# Altium schematic sheet sem8700.SchDoc
size A3
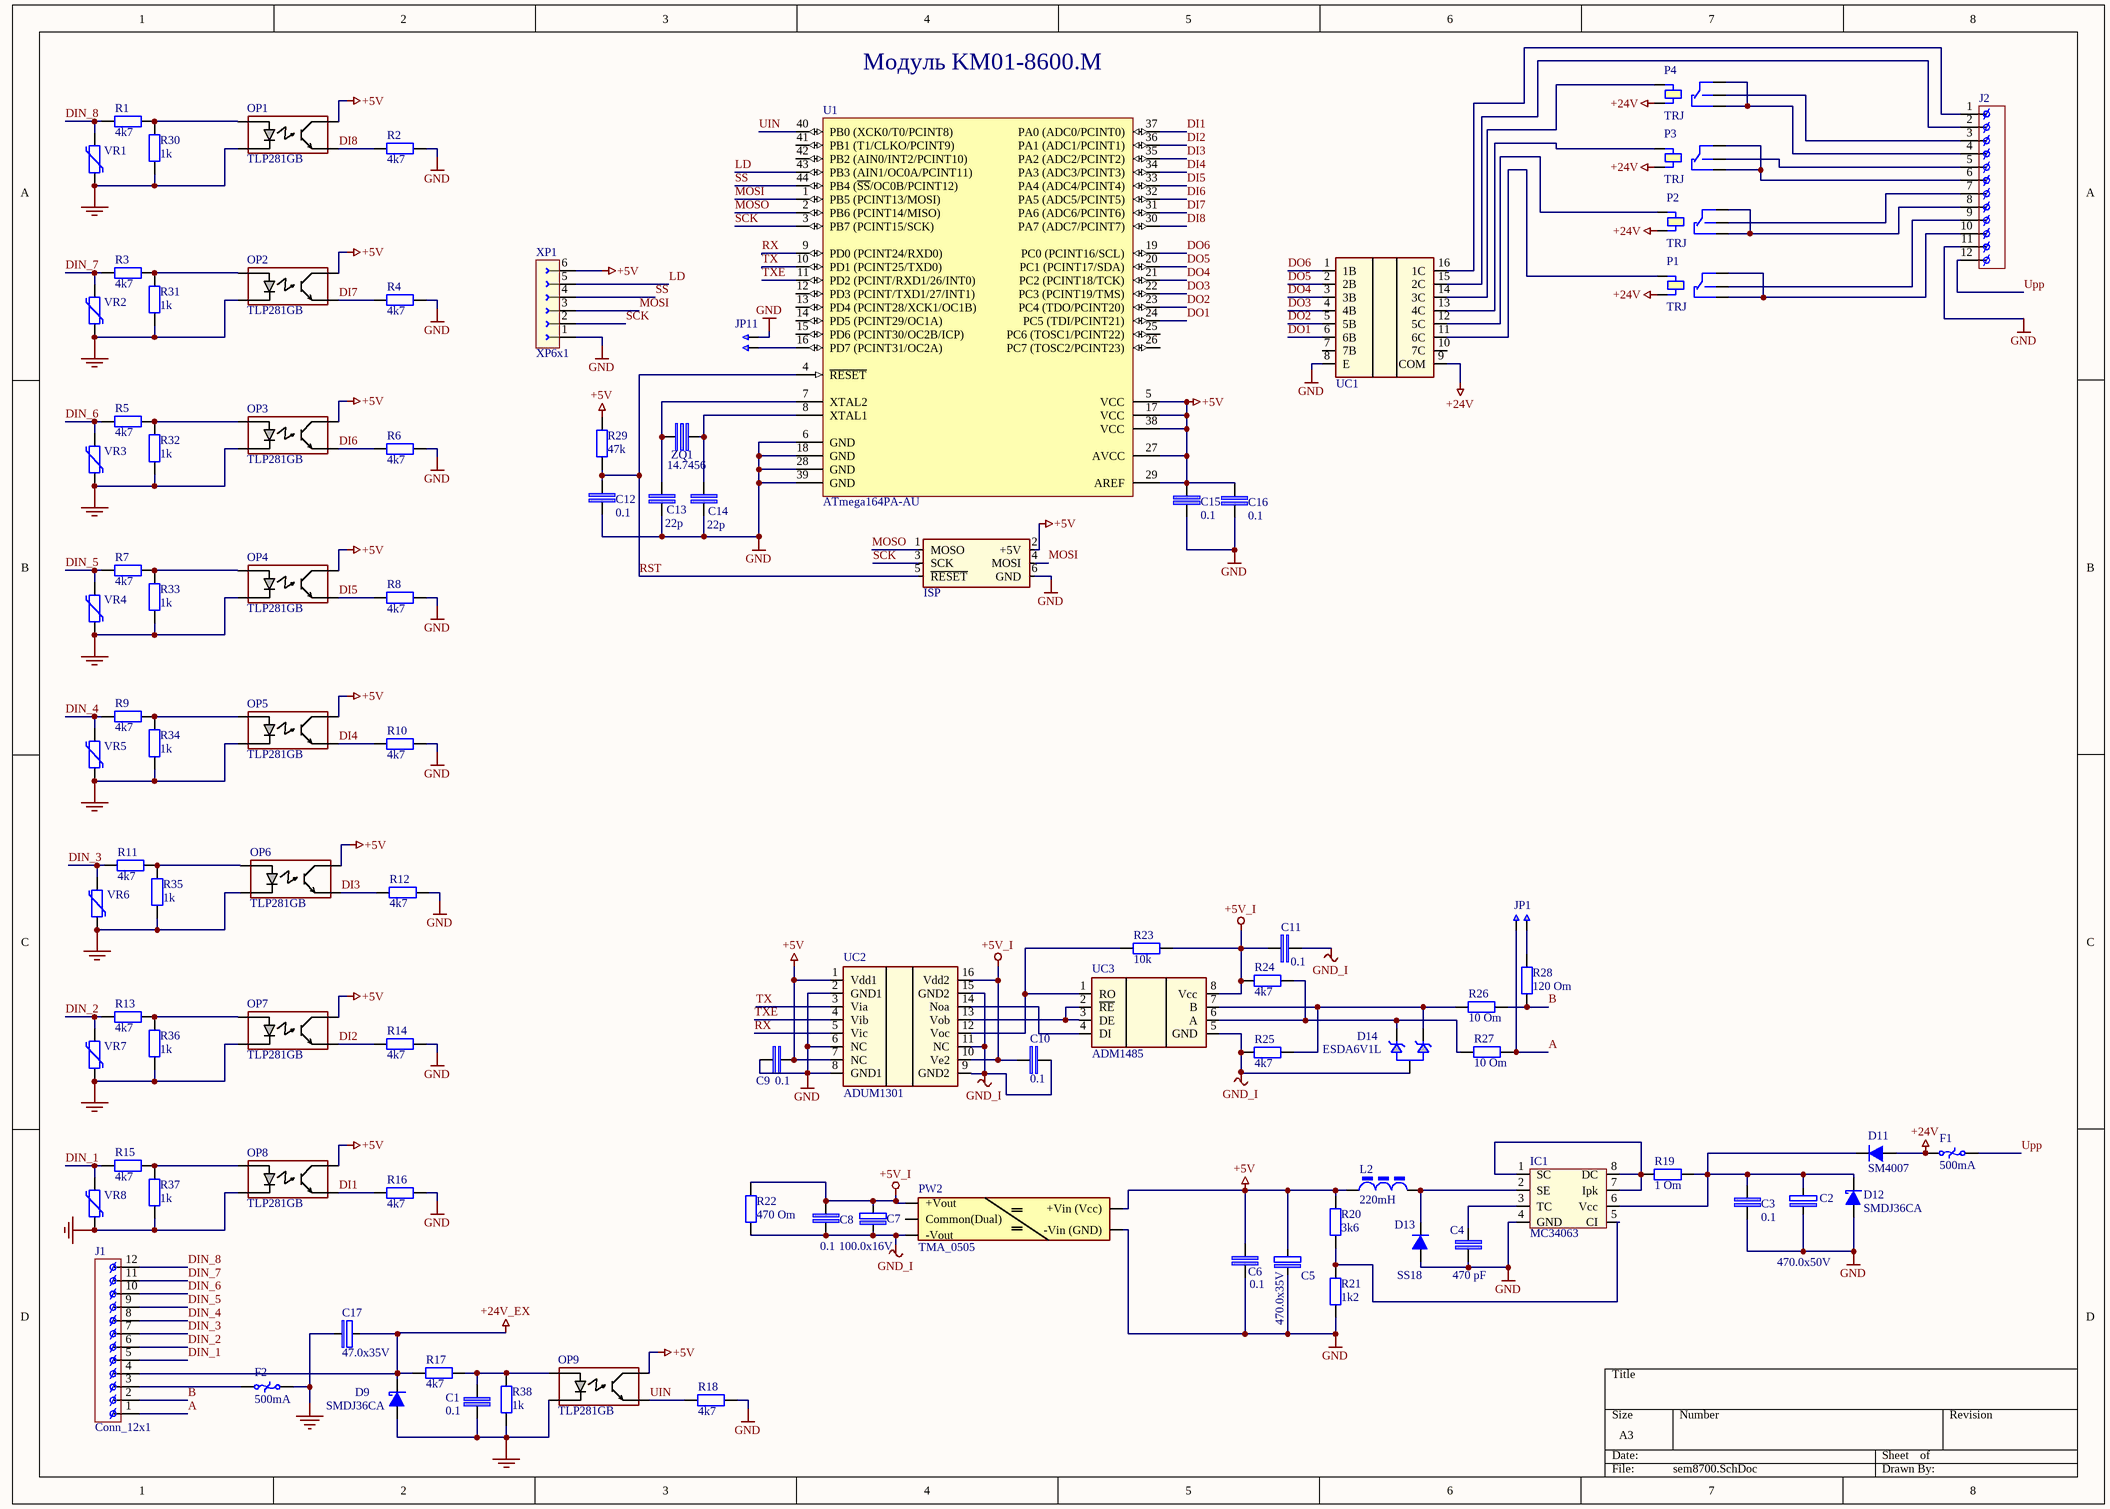
[diagram p0: sem8700.SchDoc]

## Parts
C1  0.1  [CAPC2113X13N_0805]
C2  470.0x50V  [Cap_pol_13x25]
C3  0.1  [CAPC2113X13N_0805]
C4  470 pF  [CAPC2113X13N_0805]
C5  470.0x35V  [Cap_2(10x12.5)]
C6  0.1  [CAPC2113X13N_0805]
C7  100.0x16V  [Cap_4(5x10)]
C8  0.1  [CAPC2113X13N_0805]
C9  0.1  [CAPC2113X13N_0805]
C10  0.1  [CAPC2113X13N_0805]
C11  0.1  [CAPC2113X13N_0805]
C12  0.1  [CAPC2113X13N_0805]
C13  22p  [CAPC2113X13N_0805]
C14  22p  [CAPC2113X13N_0805]
C15  0.1  [CAPC2113X13N_0805]
C16  0.1  [CAPC2113X13N_0805]
C17  47.0x35V  [Cap_4(5x10)]
D9  SMDJ36CA  [SMB_1]
D11  SM4007  [DIOD_SM1]
D12  SMDJ36CA  [SMB_1]
D13  SS18  [DIOD_SMA]
D14  ESDA6V1L  [SOT23_diod_ESDA]
F1  500mA  [Fuse_termo]
F2  500mA  [Fuse_termo]
IC1  MC34063  [SOIC_SO-8]
ISP  ISP  [ISP_1]  (value not drawn)
J1  Conn_12x1  [conn12_2]
J2  Conn_12x1  [conn12_2]  (value not drawn)
JP1  jamper  [JP_2_2.5]  (value not drawn)
JP11  jamper  [JP_2_2.5]  (value not drawn)
L2  220mH  [Dr_1]
OP1  TLP281GB  [SOIC127_TPL]
OP2  TLP281GB  [SOIC127_TPL]
OP3  TLP281GB  [SOIC127_TPL]
OP4  TLP281GB  [SOIC127_TPL]
OP5  TLP281GB  [SOIC127_TPL]
OP6  TLP281GB  [SOIC127_TPL]
OP7  TLP281GB  [SOIC127_TPL]
OP8  TLP281GB  [SOIC127_TPL]
OP9  TLP281GB  [SOIC127_TPL]
P1  TRJ  [PCB_RELE_TRJ1]
P2  TRJ  [PCB_RELE_TRJ1]
P3  TRJ  [PCB_RELE_TRJ1]
P4  TRJ  [PCB_RELE_TRJ1]
PW2  TMA_0505  [TMA_1W_new]
R1  4k7  [RES_1206]
R2  4k7  [RESC2113X0805N]
R3  4k7  [RES_1206]
R4  4k7  [RESC2113X0805N]
R5  4k7  [RES_1206]
R6  4k7  [RESC2113X0805N]
R7  4k7  [RES_1206]
R8  4k7  [RESC2113X0805N]
R9  4k7  [RES_1206]
R10  4k7  [RESC2113X0805N]
R11  4k7  [RES_1206]
R12  4k7  [RESC2113X0805N]
R13  4k7  [RES_1206]
R14  4k7  [RESC2113X0805N]
R15  4k7  [RES_1206]
R16  4k7  [RESC2113X0805N]
R17  4k7  [RES_1206]
R18  4k7  [RESC2113X0805N]
R19  1 Om  [RES_1206]
R20  3k6  [RESC2113X0805N]
R21  1k2  [RESC2113X0805N]
R22  470 Om  [RES_1206]
R23  10k  [RESC2113X0805N]
R24  4k7  [RESC2113X0805N]
R25  4k7  [RESC2113X0805N]
R26  10 Om  [RESC2113X0805N]
R27  10 Om  [RESC2113X0805N]
R28  120 Om  [RES_1206]
R29  47k  [RESC2113X0805N]
R30  1k  [RESC2113X0805N]
R31  1k  [RESC2113X0805N]
R32  1k  [RESC2113X0805N]
R33  1k  [RESC2113X0805N]
R34  1k  [RESC2113X0805N]
R35  1k  [RESC2113X0805N]
R36  1k  [RESC2113X0805N]
R37  1k  [RESC2113X0805N]
R38  1k  [RESC2113X0805N]
U1  ATmega164PA-AU  [44A_N]
UC1  ULN2003A  [PDIP16_1]  (value not drawn)
UC2  ADUM1301  [SOIC127P1030X265-16N_SOIC_W]
UC3  ADM1485  [SOIC127P600X175-8N_SOIC_SO8]
VR1  CN1206K25G  [var1206]  (value not drawn)
VR2  CN1206K25G  [var1206]  (value not drawn)
VR3  CN1206K25G  [var1206]  (value not drawn)
VR4  CN1206K25G  [var1206]  (value not drawn)
VR5  CN1206K25G  [var1206]  (value not drawn)
VR6  CN1206K25G  [var1206]  (value not drawn)
VR7  CN1206K25G  [var1206]  (value not drawn)
VR8  CN1206K25G  [var1206]  (value not drawn)
XP1  XP6x1  [CONN_WF-6]
ZQ1  14.7456  [ZQ_1]

## Nets
+5V: C5.1 C6.1 C9.1 C15.1 C16.1 ISP.2(+5V) L2.2 OP1.4 OP2.4 OP3.4 OP4.4 OP5.4 OP6.4 OP7.4 OP8.4 OP9.4 PW2.1(+Vin_(Vcc)) R20.2 R29.2 U1.5(VCC) U1.17(VCC) U1.27(AVCC) U1.29(AREF) U1.38(VCC) UC2.1(Vdd1) UC2.7(NC) XP1.6
+5V_I: C7.1 C8.1 C10.1 C11.2 PW2.5(+Vout) R22.1 R23.1 R24.2 UC2.10(Ve2) UC2.16(Vdd2) UC3.8(Vcc)
+24V: D11.1 F1.1 P1.5 P2.5 P3.5 P4.5 UC1.9(COM)
+24V_EX: C17.1 D9.1 J1.4 R17.1
GND: C2.2 C3.2 C4.2 C5.2 C6.2 C9.2 C12.2 C13.2 C14.2 C15.2 C16.2 D12.2 D13.1 IC1.4(GND) ISP.6(GND) J2.11 JP11.2 PW2.2(-Vin_(GND)) R2.2 R4.2 R6.2 R8.2 R10.2 R12.2 R14.2 R16.2 R18.2 R21.1 U1.6(GND) U1.18(GND) U1.28(GND) U1.39(GND) UC1.8(E) UC2.2(GND1) UC2.6(NC) UC2.8(GND1) XP1.1
GND_EX: C1.2 C17.2 D9.2 F2.2 OP1.2 OP2.2 OP3.2 OP4.2 OP5.2 OP6.2 OP7.2 OP8.2 OP9.2 R30.1 R31.1 R32.1 R33.1 R34.1 R35.1 R36.1 R37.1 R38.1 VR1.1 VR2.1 VR3.1 VR4.1 VR5.1 VR6.1 VR7.1 VR8.1
GND_I: C7.2 C8.2 C10.2 C11.1 D14.3 PW2.3(-Vout) R22.2 R25.2 UC2.9(GND2) UC2.11(NC) UC2.15(GND2) UC3.5(GND)
A: J1.1 JP1.1 R27.1
B: J1.2 R26.1 R28.1
DI1: OP8.3 R16.1 U1.37(PA0_(ADC0/PCINT0))
DI2: OP7.3 R14.1 U1.36(PA1_(ADC1/PCINT1))
DI3: OP6.3 R12.1 U1.35(PA2_(ADC2/PCINT2))
DI4: OP5.3 R10.1 U1.34(PA3_(ADC3/PCINT3))
DI5: OP4.3 R8.1 U1.33(PA4_(ADC4/PCINT4))
DI6: OP3.3 R6.1 U1.32(PA5_(ADC5/PCINT5))
DI7: OP2.3 R4.1 U1.31(PA6_(ADC6/PCINT6))
DI8: OP1.3 R2.1 U1.30(PA7_(ADC7/PCINT7))
DIN_1: J1.5 R15.1 VR8.2
DIN_2: J1.6 R13.1 VR7.2
DIN_3: J1.7 R11.1 VR6.2
DIN_4: J1.8 R9.1 VR5.2
DIN_5: J1.9 R7.1 VR4.2
DIN_6: J1.10 R5.1 VR3.2
DIN_7: J1.11 R3.1 VR2.2
DIN_8: J1.12 R1.1 VR1.2
DO1: U1.24(PC5_(TDI/PCINT21)) UC1.6(6B)
DO2: U1.23(PC4_(TDO/PCINT20)) UC1.5(5B)
DO3: U1.22(PC3_(PCINT19/TMS)) UC1.4(4B)
DO4: U1.21(PC2_(PCINT18/TCK)) UC1.3(3B)
DO5: U1.20(PC1_(PCINT17/SDA)) UC1.2(2B)
DO6: U1.19(PC0_(PCINT16/SCL)) UC1.1(1B)
LD: U1.43(PB3_(AIN1/OC0A/PCINT11)) XP1.5
MOSI: ISP.4(MOSI) U1.1(PB5_(PCINT13/MOSI)) XP1.3
MOSO: ISP.1(MOSO) U1.2(PB6_(PCINT14/MISO))
RST: C12.1 ISP.5(~{RESET}) R29.1 U1.4(~{RESET})
RX: U1.9(PD0_(PCINT24/RXD0)) UC2.5(Vic)
SCK: ISP.3(SCK) U1.3(PB7_(PCINT15/SCK)) XP1.2
SS: U1.44(PB4_(~{SS}/OC0B/PCINT12)) XP1.4
TX: U1.10(PD1_(PCINT25/TXD0)) UC2.3(Via)
TXE: U1.11(PD2_(PCINT/RXD1/26/INT0)) UC2.4(Vib)
UIN: OP9.3 R18.1 U1.40(PB0_(XCK0/T0/PCINT8))
Upp: F1.2 J2.12
NetC1_1: C1.1 OP9.1 R17.2 R38.2
NetC2_1: C2.1 C3.1 D11.2 D12.1 IC1.6(Vcc) R19.2
NetC4_1: C4.1 IC1.3(TC)
NetC13_1: C13.1 U1.7(XTAL2) ZQ1.1
NetC14_1: C14.1 U1.8(XTAL1) ZQ1.2
NetD13_2: D13.2 IC1.2(SE) L2.1
NetD14_1: D14.1 R25.1 R26.2 UC3.7(B)
NetD14_2: D14.2 R24.1 R27.2 UC3.6(A)
NetF2_1: F2.1 J1.3
NetIC1_1: IC1.1(SC) IC1.7(Ipk) IC1.8(DC) R19.1
NetIC1_5: IC1.5(CI) R20.1 R21.2
NetJ2_1: J2.1 UC1.16(1C)
NetJ2_2: J2.2 UC1.15(2C)
NetJ2_3: J2.3 P4.3
NetJ2_4: J2.4 P4.2 P4.4
NetJ2_5: J2.5 P3.3
NetJ2_6: J2.6 P3.2 P3.4
NetJ2_7: J2.7 P2.3
NetJ2_8: J2.8 P2.2 P2.4
NetJ2_9: J2.9 P1.3
NetJ2_10: J2.10 P1.2 P1.4
NetJP1_2: JP1.2 R28.2
NetJP11_1: JP11.1 U1.16(PD7_(PCINT31/OC2A))
NetOP1_1: OP1.1 R1.2 R30.2
NetOP2_1: OP2.1 R3.2 R31.2
NetOP3_1: OP3.1 R5.2 R32.2
NetOP4_1: OP4.1 R7.2 R33.2
NetOP5_1: OP5.1 R9.2 R34.2
NetOP6_1: OP6.1 R11.2 R35.2
NetOP7_1: OP7.1 R13.2 R36.2
NetOP8_1: OP8.1 R15.2 R37.2
NetP1_1: P1.1 UC1.11(6C)
NetP2_1: P2.1 UC1.12(5C)
NetP3_1: P3.1 UC1.13(4C)
NetP4_1: P4.1 UC1.14(3C)
NetR23_2: R23.2 UC2.12(Voc) UC3.1(RO)
NetUC2_13: UC2.13(Vob) UC3.2(~{RE}) UC3.3(DE)
NetUC2_14: UC2.14(Noa) UC3.4(DI)

Not connected (* = marked no-connect by the designer): PW2 4(Common(Dual)); U1 12(PD3_(PCINT/TXD1/27/INT1)) 13(PD4_(PCINT28/XCK1/OC1B)) 14(PD5_(PCINT29/OC1A)) 15(PD6_(PCINT30/OC2B/ICP)) 25(PC6_(TOSC1/PCINT22)) 26(PC7_(TOSC2/PCINT23)) 41(PB1_(T1/CLKO/PCINT9)) 42(PB2_(AIN0/INT2/PCINT10)); UC1 7(7B) 10(7C)

## Notes on the sheet
- Модуль KM01-8600.M

## Library data of the parts
C1 C3 C4 C6 C8-C16 = cap_1
C2 = Cap_pol1
C5 C7 C17 = Cap_pol2
D9 D12 = Diodes_SMB
D11 = Diodes_4007
D13 = Diod_30BQ100
D14 = Diod_ESDA
F1 F2 = Fuse_term
IC1 = MC34063_1
ISP = ISP_1
JP1 JP11 = JP_2x2.5
L2 = Dr_1
OP1-OP9 = opto_TLP
P1-P4 = Rele_TRJ
PW2 = TRACO_PW1
R1-R38 = rez_1
U1 = ATmega164PA-AU: 8-bit AVR Microcontroller, 16KB Flash, 512 Bytes EEPROM, 1KB SRAM, 44-pin TQFP, Industrial Grade (-40°C to 85°C); Published: 1-Apr-2010; DatasheetVersion: revA, Jan-2010; PackageVersion: rev.B, Oct-2001; PackageReference: 44A; Publisher: Altium Limited; PackageDescription: 44-Pin Plastic Thin Profile Quad Flat Pack, 10 x 10 x 1.0 mm Body, 0.8 mm Pitch (TQFP); Supplier 1: Digi-Key; Supplier Part Number 1: ATMEGA164PA-AU-ND; Supplier 2: Farnell; Supplier Part Number 2: 1748513; Supplier 3: Mouser; Supplier Part Number 3: 556-ATMEGA164PA-AU; ComponentLink1Description: Manufacturer Link; ComponentLink1URL: http://www.atmel.com/products/avr/default.asp?; ComponentLink2Description: ATmega164A/164PA/324A/324PA/644A/644PA/1284/1284P Datasheet; ComponentLink2URL: http://www.atmel.com/dyn/resources/prod_documents/doc8272.pdf; ComponentLink3Description: ATmega164A/164PA/324A/324PA/644A/644PA/1284/1284P Summary; ComponentLink3URL: http://www.atmel.com/dyn/resources/prod_documents/8272S.pdf; ComponentLink4Description: Atmel.com Home; ComponentLink4URL: http://www.atmel.com
UC3 = ADM485
VR1-VR8 = var_smd1
XP1 = Connect6_1
ZQ1 = ZQ_1